# EAGLE schematic shem (EAGLE 9.5.2)
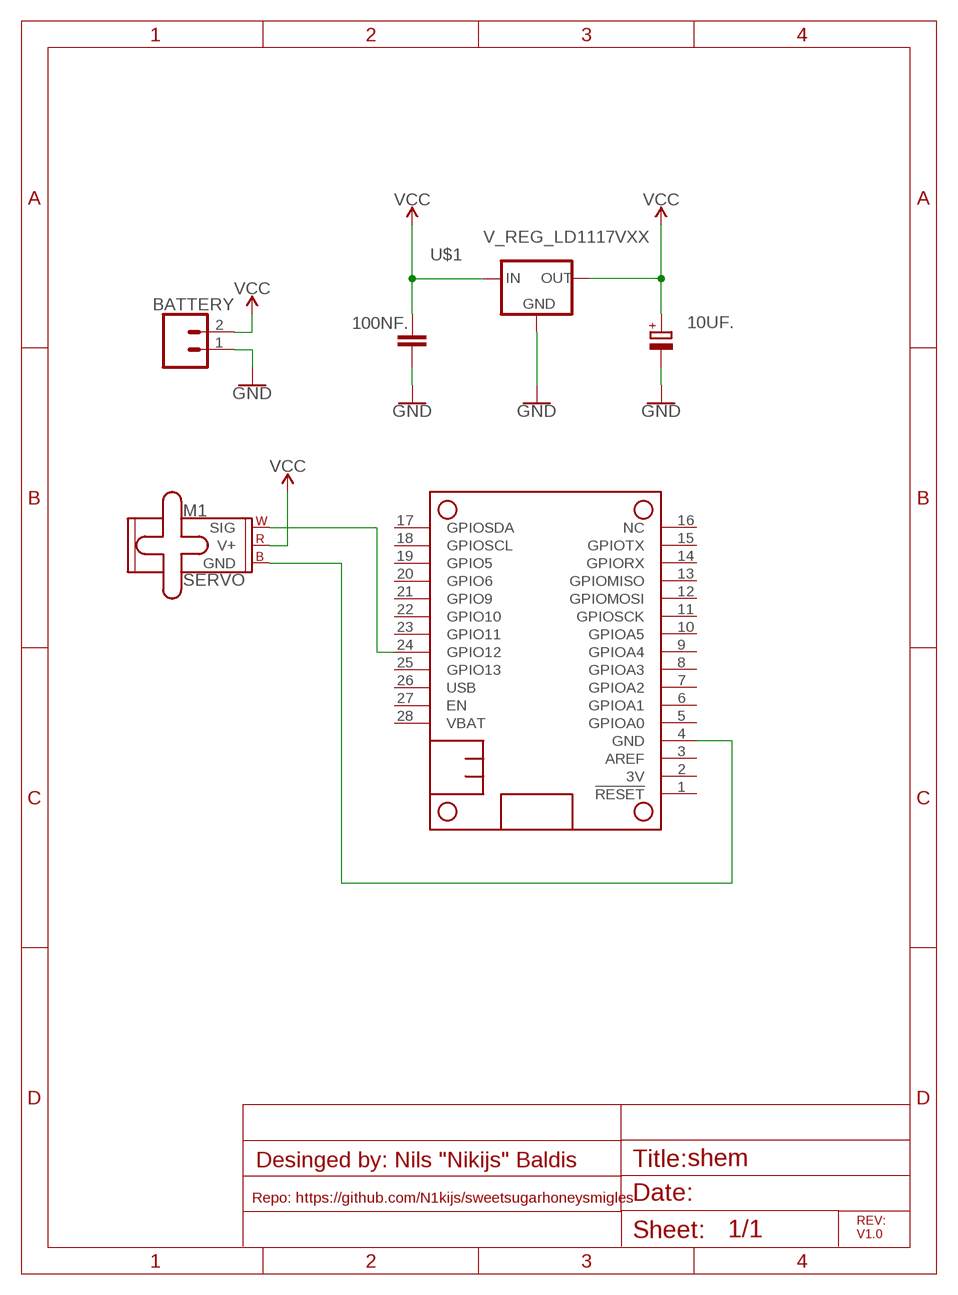
[diagram p0: schematic, sheet 1]

## Parts
10UF.  CPOL-EUE1.8-4  [E1,8-4]
100NF.  C-EU025-025X050  [C025-025X050]
BATTERY  M02  [02P]
M1  SERVO  [1X03]
MS1  FEATHERWING  [FEATHERWING]
U$1  V_REG_LD1117VXX  [78XXL]

## Nets
GND: 10UF..- 100NF..2 BATTERY.1 U$1.IN(GND)
N$1: M1.1(SIG) MS1.24(GPIO12)
N$3: M1.3(GND) MS1.4(GND)
VCC: 10UF..+ 100NF..1 BATTERY.2 M1.2(V+) U$1.GND(OUT) U$1.OUT(IN)
Unconnected: MS1.1(!RESET) MS1.2(3V) MS1.3(AREF) MS1.5(GPIOA0) MS1.6(GPIOA1) MS1.7(GPIOA2) MS1.8(GPIOA3) MS1.9(GPIOA4) MS1.10(GPIOA5) MS1.11(GPIOSCK) MS1.12(GPIOMOSI) MS1.13(GPIOMISO) MS1.14(GPIORX) MS1.15(GPIOTX) MS1.16(NC) MS1.17(GPIOSDA) MS1.18(GPIOSCL) MS1.19(GPIO5) MS1.20(GPIO6) MS1.21(GPIO9) MS1.22(GPIO10) MS1.23(GPIO11) MS1.25(GPIO13) MS1.26(USB) MS1.27(EN) MS1.28(VBAT)

## Notes on the sheet
- Desinged by: Nils "Nikijs" Baldis | Title:
- Repo: https://github.com/N1kijs/sweetsugarhoneysmigles | Date:
- REV:
  V1.0

## Library data of the parts
10UF. = resistor:CPOL-EU: POLARIZED CAPACITOR, European symbol
100NF. = resistor:C-EU: CAPACITOR, European symbol
BATTERY = con-amp-quick:M02: AMP QUICK CONNECTOR; OC_FARNELL: unknown; OC_NEWARK: unknown
M1 = SparkFun-Electromechanical:SERVO: Servo Motor 3-pin connector for a standard servo motor (voltage supply, ground, and control signal.) SparkFun Products Servo - Generic (Sub-Micro Size) <https://www.sparkfun.com/products/9065> (ROB-09065) Servo - Generic High Torque Continuous Rotation (Standard Size) <https://www.sparkfun.com/products/9347> (ROB-09347) Servo - Generic High Torque (Standard Size) <https://www.sparkfun.com/products/11965> (ROB-11965)
MS1 = adafruit:FEATHERWING
U$1 = SparkFun-IC-Power:V_REG_LD1117VXX: LD1117VXX voltage regulator. We carry the 3.3V version (COM-00526) in TO-220 package.